# Altium schematic sheet MCU.SchDoc
size A3; DocumentNumber: 5; SheetNumber: 5; SheetTotal: 10
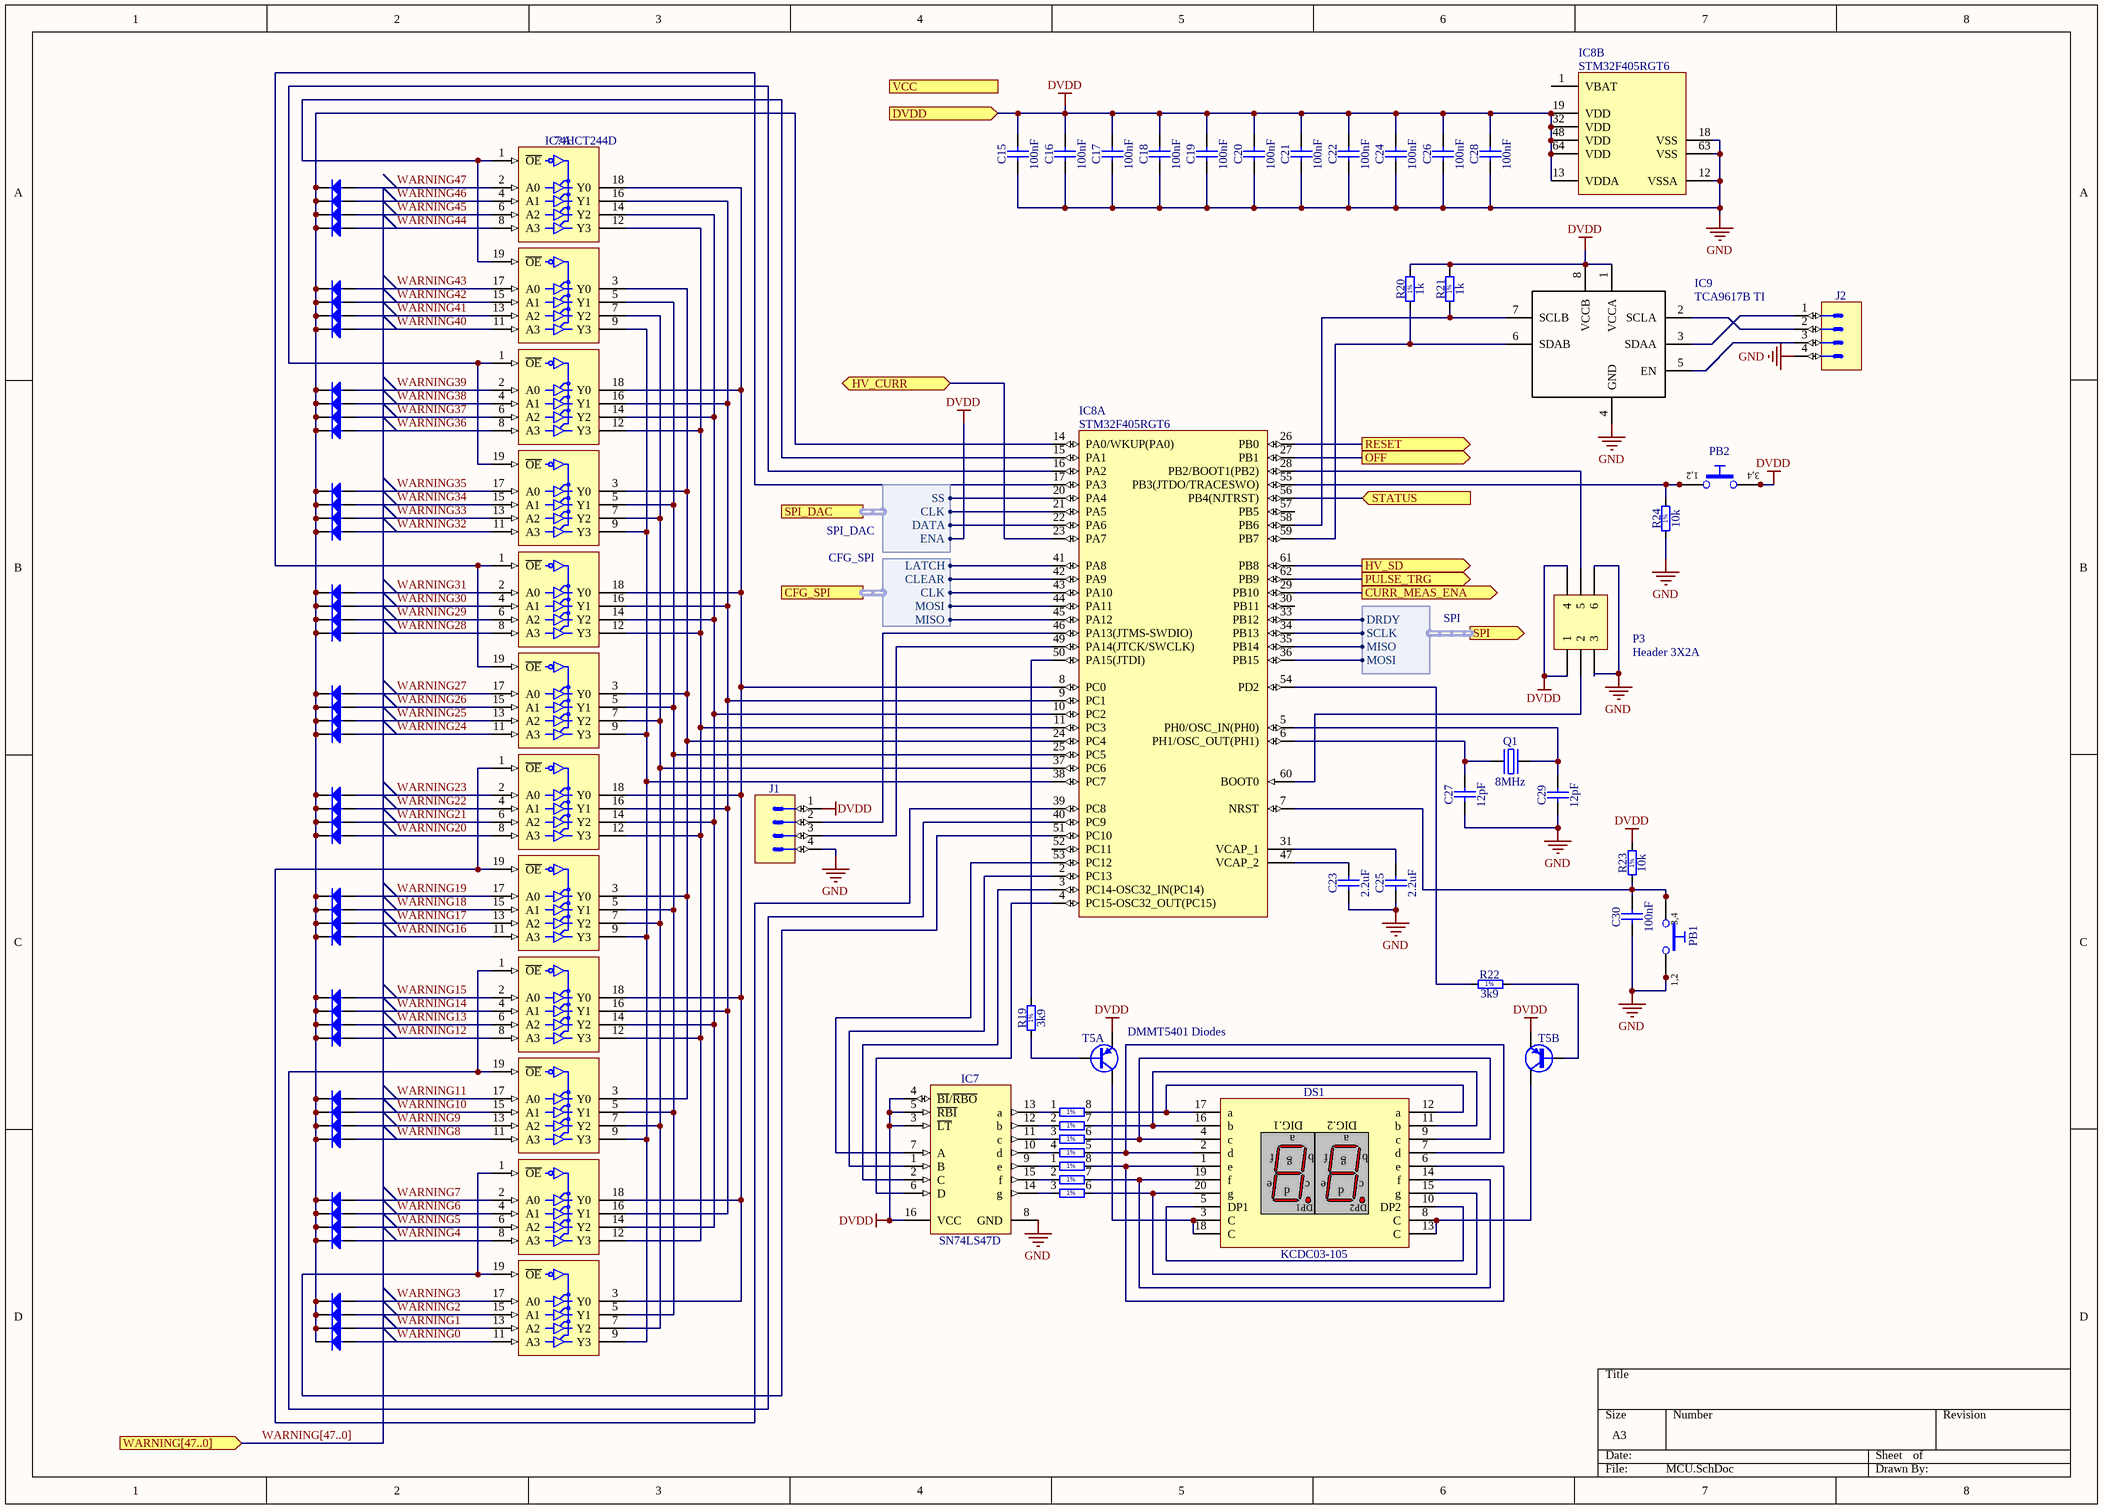
[diagram p0: MCU.SchDoc]

## Parts
(Parts that share a designator on the sheet are numbered #1, #2 ... from top to bottom, then left to right.)
C15  100nF  [CAPC2012X135N]
C16  100nF  [CAPC2012X135N]
C17  100nF  [CAPC2012X135N]
C18  100nF  [CAPC2012X135N]
C19  100nF  [CAPC2012X135N]
C20  100nF  [CAPC2012X135N]
C21  100nF  [CAPC2012X135N]
C22  100nF  [CAPC2012X135N]
C23  2.2uF  [CAPC3216X180N]
C24  100nF  [CAPC2012X135N]
C25  2.2uF  [CAPC3216X180N]
C26  100nF  [CAPC2012X135N]
C27  12pF  [CAPC2012X135N]
C28  100nF  [CAPC2012X135N]
C29  12pF  [CAPC2012X135N]
C30  100nF  [CAPC2012X135N]
D3  MCL4148-TR3  [DIOMELF1911N]  (value not drawn)
D4  MCL4148-TR3  [DIOMELF1911N]  (value not drawn)
D5  MCL4148-TR3  [DIOMELF1911N]  (value not drawn)
D6  MCL4148-TR3  [DIOMELF1911N]  (value not drawn)
D7  MCL4148-TR3  [DIOMELF1911N]  (value not drawn)
D8#1  MCL4148-TR3  [DIOMELF1911N]  (value not drawn)
D8#2  MCL4148-TR3  [DIOMELF1911N]  (value not drawn)
D9  MCL4148-TR3  [DIOMELF1911N]  (value not drawn)
D?#1  MCL4148-TR3  [DIOMELF1911N]  (value not drawn)
D?#2  MCL4148-TR3  [DIOMELF1911N]  (value not drawn)
D?#3  MCL4148-TR3  [DIOMELF1911N]  (value not drawn)
D?#4  MCL4148-TR3  [DIOMELF1911N]  (value not drawn)
D?#5  MCL4148-TR3  [DIOMELF1911N]  (value not drawn)
D?#6  MCL4148-TR3  [DIOMELF1911N]  (value not drawn)
D?#7  MCL4148-TR3  [DIOMELF1911N]  (value not drawn)
D?#8  MCL4148-TR3  [DIOMELF1911N]  (value not drawn)
D?#9  MCL4148-TR3  [DIOMELF1911N]  (value not drawn)
D?#10  MCL4148-TR3  [DIOMELF1911N]  (value not drawn)
D?#11  MCL4148-TR3  [DIOMELF1911N]  (value not drawn)
D?#12  MCL4148-TR3  [DIOMELF1911N]  (value not drawn)
D?#13  MCL4148-TR3  [DIOMELF1911N]  (value not drawn)
D?#14  MCL4148-TR3  [DIOMELF1911N]  (value not drawn)
D?#15  MCL4148-TR3  [DIOMELF1911N]  (value not drawn)
D?#16  MCL4148-TR3  [DIOMELF1911N]  (value not drawn)
D?#17  MCL4148-TR3  [DIOMELF1911N]  (value not drawn)
D?#18  MCL4148-TR3  [DIOMELF1911N]  (value not drawn)
D?#19  MCL4148-TR3  [DIOMELF1911N]  (value not drawn)
D?#20  MCL4148-TR3  [DIOMELF1911N]  (value not drawn)
D?#21  MCL4148-TR3  [DIOMELF1911N]  (value not drawn)
D?#22  MCL4148-TR3  [DIOMELF1911N]  (value not drawn)
D?#23  MCL4148-TR3  [DIOMELF1911N]  (value not drawn)
D?#24  MCL4148-TR3  [DIOMELF1911N]  (value not drawn)
D?#25  MCL4148-TR3  [DIOMELF1911N]  (value not drawn)
D?#26  MCL4148-TR3  [DIOMELF1911N]  (value not drawn)
D?#27  MCL4148-TR3  [DIOMELF1911N]  (value not drawn)
D?#28  MCL4148-TR3  [DIOMELF1911N]  (value not drawn)
D?#29  MCL4148-TR3  [DIOMELF1911N]  (value not drawn)
D?#30  MCL4148-TR3  [DIOMELF1911N]  (value not drawn)
D?#31  MCL4148-TR3  [DIOMELF1911N]  (value not drawn)
D?#32  MCL4148-TR3  [DIOMELF1911N]  (value not drawn)
D?#33  MCL4148-TR3  [DIOMELF1911N]  (value not drawn)
D?#34  MCL4148-TR3  [DIOMELF1911N]  (value not drawn)
D?#35  MCL4148-TR3  [DIOMELF1911N]  (value not drawn)
D?#36  MCL4148-TR3  [DIOMELF1911N]  (value not drawn)
D?#37  MCL4148-TR3  [DIOMELF1911N]  (value not drawn)
D?#38  MCL4148-TR3  [DIOMELF1911N]  (value not drawn)
D?#39  MCL4148-TR3  [DIOMELF1911N]  (value not drawn)
D?#40  MCL4148-TR3  [DIOMELF1911N]  (value not drawn)
DS1  KCDC03-105  [DS_KINGBRIGHT_KCDC03-105]
IC7  SN74LS47D  [SOIC127P600X175-16N]
IC8  STM32F405RGT6  [QFP50P1200X1200X160-64N]  (parts A,B of 2)
IC9  TCA9617B TI  [TSOP65P490X110-8N]
IC?#1  74HCT244D  [SOIC127P1032X265-20N]  (part A of 2)
IC?#2  74HCT244D  [SOIC127P1032X265-20N]  (value not drawn)  (part B of 2)
IC?#3  74HCT244D  [SOIC127P1032X265-20N]  (value not drawn)  (part A of 2)
IC?#4  74HCT244D  [SOIC127P1032X265-20N]  (value not drawn)  (part B of 2)
IC?#5  74HCT244D  [SOIC127P1032X265-20N]  (value not drawn)  (part A of 2)
IC?#6  74HCT244D  [SOIC127P1032X265-20N]  (value not drawn)  (part B of 2)
IC?#7  74HCT244D  [SOIC127P1032X265-20N]  (value not drawn)  (part A of 2)
IC?#8  74HCT244D  [SOIC127P1032X265-20N]  (value not drawn)  (part B of 2)
IC?#9  74HCT244D  [SOIC127P1032X265-20N]  (value not drawn)  (part A of 2)
IC?#10  74HCT244D  [SOIC127P1032X265-20N]  (value not drawn)  (part B of 2)
IC?#11  74HCT244D  [SOIC127P1032X265-20N]  (value not drawn)  (part A of 2)
IC?#12  74HCT244D  [SOIC127P1032X265-20N]  (value not drawn)  (part B of 2)
J1  Header 4  [PRECI-DIP_350-V3-104-00-001101]  (value not drawn)
J2  Header 4  [PRECI-DIP_350-V3-104-00-001101]  (value not drawn)
P3  Header 3X2A  [HDR2X3_CEN]
PB1  Push Button  [PB_OMRON_B3F-1000]  (value not drawn)
PB2  Push Button  [PB_OMRON_B3F-1000]  (value not drawn)
Q1  8MHz  [XTAL_TXC_7A]
R19  3k9  [RESC2012X60N]
R20  1k  [RESC2012X60N]
R21  1k  [RESC2012X60N]
R22  3k9  [RESC2012X60N]
R23  10k  [RESC2012X60N]
R24  10k  [RESC2012X60N]
RN1  220  [RN_VISHAY_CRA12E08]  (value not drawn)  (parts A,B,C,D of 4)
RN2  220  [RN_VISHAY_CRA12E08]  (value not drawn)  (parts A,B,C of 4)
T5  DMMT5401 Diodes  [SOT95P280X145-6N]  (parts A,B of 2)

## Ports
CFG_SPI (harness CFG_SPI), CURR_MEAS_ENA (out), DVDD (in), HV_CURR (bidir), HV_SD (out), OFF (out), PULSE_TRG (out), RESET (out), SPI (out, harness SPI), SPI_DAC (harness SPI_DAC), STATUS (in), VCC (in), WARNING[47..0] (in)

## Harnesses
SPI_DAC: SS, CLK, DATA, ENA
SPI: DRDY, MISO, SCLK, MOSI
CFG_SPI: LATCH, CLEAR, CLK, MOSI, MISO

## Nets
DVDD: C15.2 C16.2 C17.2 C18.2 C19.2 C20.2 C21.2 C22.2 C24.2 C26.2 C28.2 IC7.3(~{LT}) IC7.4(~{BI}/~{RBO}) IC7.5(~{RBI}) IC7.16(VCC) IC8.13(VDDA) IC8.19(VDD) IC8.32(VDD) IC8.48(VDD) IC8.64(VDD) IC9.1(VCCA) IC9.8(VCCB) J1.1 P3.1 P3.4 PB2.3 PB2.4 R20.2 R21.2 R23.2 T5.5(E) T5.6(E) ; port DVDD, port SPI_DAC.ENA
GND: C15.1 C16.1 C17.1 C18.1 C19.1 C20.1 C21.1 C22.1 C23.1 C24.1 C25.1 C26.1 C27.1 C28.1 C29.1 C30.1 IC7.8(GND) IC8.12(VSSA) IC8.18(VSS) IC8.63(VSS) IC9.4(GND) IC?#1.10(GND) IC?#2.10(GND) IC?#3.10(GND) IC?#4.10(GND) IC?#5.10(GND) IC?#6.10(GND) IC?#7.10(GND) IC?#8.10(GND) IC?#9.10(GND) IC?#10.10(GND) IC?#11.10(GND) IC?#12.10(GND) J1.4 J2.4 P3.3 P3.6 PB1.1 PB1.2 R24.1
VCC: IC?#1.20(VCC) IC?#2.20(VCC) IC?#3.20(VCC) IC?#4.20(VCC) IC?#5.20(VCC) IC?#6.20(VCC) IC?#7.20(VCC) IC?#8.20(VCC) IC?#9.20(VCC) IC?#10.20(VCC) IC?#11.20(VCC) IC?#12.20(VCC)
CURR_MEAS_ENA: IC8.29(PB10) ; port CURR_MEAS_ENA
HV_CURR: IC8.23(PA7) ; port HV_CURR
HV_SD: IC8.61(PB8) ; port HV_SD
OFF: IC8.27(PB1) ; port OFF
PULSE_TRG: IC8.62(PB9) ; port PULSE_TRG
RESET: IC8.26(PB0) ; port RESET
STATUS: IC8.56(PB4(NJTRST)) ; port STATUS
WARNING0: D?#40.2(A) IC?#12.11(A3)
WARNING1: D?#39.2(A) IC?#12.13(A2)
WARNING2: D?#38.2(A) IC?#12.15(A1)
WARNING3: D?#37.2(A) IC?#12.17(A0)
WARNING4: D?#36.2(A) IC?#11.8(A3)
WARNING5: D?#35.2(A) IC?#11.6(A2)
WARNING6: D?#34.2(A) IC?#11.4(A1)
WARNING7: D?#33.2(A) IC?#11.2(A0)
WARNING8: D?#32.2(A) IC?#10.11(A3)
WARNING9: D?#31.2(A) IC?#10.13(A2)
WARNING10: D?#30.2(A) IC?#10.15(A1)
WARNING11: D?#29.2(A) IC?#10.17(A0)
WARNING12: D?#28.2(A) IC?#9.8(A3)
WARNING13: D?#27.2(A) IC?#9.6(A2)
WARNING14: D?#26.2(A) IC?#9.4(A1)
WARNING15: D?#25.2(A) IC?#9.2(A0)
WARNING16: D?#24.2(A) IC?#8.11(A3)
WARNING17: D?#23.2(A) IC?#8.13(A2)
WARNING18: D?#22.2(A) IC?#8.15(A1)
WARNING19: D?#21.2(A) IC?#8.17(A0)
WARNING20: D?#20.2(A) IC?#7.8(A3)
WARNING21: D?#19.2(A) IC?#7.6(A2)
WARNING22: D?#18.2(A) IC?#7.4(A1)
WARNING23: D?#17.2(A) IC?#7.2(A0)
WARNING24: D?#16.2(A) IC?#6.11(A3)
WARNING25: D?#15.2(A) IC?#6.13(A2)
WARNING26: D?#14.2(A) IC?#6.15(A1)
WARNING27: D?#13.2(A) IC?#6.17(A0)
WARNING28: D?#12.2(A) IC?#5.8(A3)
WARNING29: D?#11.2(A) IC?#5.6(A2)
WARNING30: D?#10.2(A) IC?#5.4(A1)
WARNING31: D?#9.2(A) IC?#5.2(A0)
WARNING32: D?#8.2(A) IC?#4.11(A3)
WARNING33: D?#7.2(A) IC?#4.13(A2)
WARNING34: D?#6.2(A) IC?#4.15(A1)
WARNING35: D?#5.2(A) IC?#4.17(A0)
WARNING36: D?#4.2(A) IC?#3.8(A3)
WARNING37: D?#3.2(A) IC?#3.6(A2)
WARNING38: D?#2.2(A) IC?#3.4(A1)
WARNING39: D?#1.2(A) IC?#3.2(A0)
WARNING40: D9.2(A) IC?#2.11(A3)
WARNING41: D8#2.2(A) IC?#2.13(A2)
WARNING42: D7.2(A) IC?#2.15(A1)
WARNING43: D8#1.2(A) IC?#2.17(A0)
WARNING44: D6.2(A) IC?#1.8(A3)
WARNING45: D5.2(A) IC?#1.6(A2)
WARNING46: D4.2(A) IC?#1.4(A1)
WARNING47: D3.2(A) IC?#1.2(A0)
NetC23_2: C23.2 IC8.47(VCAP_2)
NetC25_2: C25.2 IC8.31(VCAP_1)
NetC27_2: C27.2 IC8.6(PH1/OSC_OUT(PH1)) Q1.1(OSC1)
NetC29_2: C29.2 IC8.5(PH0/OSC_IN(PH0)) Q1.2(OSC2)
NetC30_2: C30.2 IC8.7(NRST) PB1.3 PB1.4 R23.1
NetD3_1: D3.1(C) D4.1(C) D5.1(C) D6.1(C) D7.1(C) D8#1.1(C) D8#2.1(C) D9.1(C) D?#1.1(C) D?#2.1(C) D?#3.1(C) D?#4.1(C) D?#5.1(C) D?#6.1(C) D?#7.1(C) D?#8.1(C) D?#9.1(C) D?#10.1(C) D?#11.1(C) D?#12.1(C) D?#13.1(C) D?#14.1(C) D?#15.1(C) D?#16.1(C) D?#17.1(C) D?#18.1(C) D?#19.1(C) D?#20.1(C) D?#21.1(C) D?#22.1(C) D?#23.1(C) D?#24.1(C) D?#25.1(C) D?#26.1(C) D?#27.1(C) D?#28.1(C) D?#29.1(C) D?#30.1(C) D?#31.1(C) D?#32.1(C) D?#33.1(C) D?#34.1(C) D?#35.1(C) D?#36.1(C) D?#37.1(C) D?#38.1(C) D?#39.1(C) D?#40.1(C) IC8.14(PA0/WKUP(PA0))
NetDS1_1: DS1.1(e) DS1.6(e) RN2.8
NetDS1_2: DS1.2(d) DS1.7(d) RN1.5
NetDS1_3: DS1.3(C) DS1.18(C) T5.1(C)
NetDS1_4: DS1.4(c) DS1.9(c) RN1.6
NetDS1_5: DS1.5(DP1) DS1.10(DP2)
NetDS1_8: DS1.8(C) DS1.13(C) T5.4(C)
NetDS1_11: DS1.11(b) DS1.16(b) RN1.7
NetDS1_12: DS1.12(a) DS1.17(a) RN1.8
NetDS1_14: DS1.14(f) DS1.19(f) RN2.7
NetDS1_15: DS1.15(g) DS1.20(g) RN2.6
NetIC7_1: IC7.1(B) IC8.2(PC13)
NetIC7_2: IC7.2(C) IC8.3(PC14-OSC32_IN(PC14))
NetIC7_6: IC7.6(D) IC8.4(PC15-OSC32_OUT(PC15))
NetIC7_7: IC7.7(A) IC8.53(PC12)
NetIC7_9: IC7.9(e) RN2.1
NetIC7_10: IC7.10(d) RN1.4
NetIC7_11: IC7.11(c) RN1.3
NetIC7_12: IC7.12(b) RN1.2
NetIC7_13: IC7.13(a) RN1.1
NetIC7_14: IC7.14(g) RN2.3
NetIC7_15: IC7.15(f) RN2.2
NetIC8_8: IC8.8(PC0) IC?#1.18(Y0) IC?#3.18(Y0) IC?#5.18(Y0) IC?#7.18(Y0) IC?#9.18(Y0) IC?#11.18(Y0) IC?#12.3(Y0)
NetIC8_9: IC8.9(PC1) IC?#1.16(Y1) IC?#3.16(Y1) IC?#5.16(Y1) IC?#7.16(Y1) IC?#9.16(Y1) IC?#11.16(Y1)
NetIC8_10: IC8.10(PC2) IC?#1.14(Y2) IC?#3.14(Y2) IC?#5.14(Y2) IC?#7.14(Y2) IC?#9.14(Y2) IC?#11.14(Y2)
NetIC8_11: IC8.11(PC3) IC?#1.12(Y3) IC?#3.12(Y3) IC?#5.12(Y3) IC?#7.12(Y3) IC?#9.12(Y3) IC?#11.12(Y3)
NetIC8_15: IC8.15(PA1) IC?#1.1(~{OE}) IC?#2.19(~{OE})
NetIC8_16: IC8.16(PA2) IC?#3.1(~{OE}) IC?#4.19(~{OE})
NetIC8_17: IC8.17(PA3) IC?#5.1(~{OE}) IC?#6.19(~{OE})
NetIC8_20: IC8.20(PA4) ; port SPI_DAC.SS
NetIC8_21: IC8.21(PA5) ; port SPI_DAC.CLK
NetIC8_22: IC8.22(PA6) ; port SPI_DAC.DATA
NetIC8_24: IC8.24(PC4) IC?#2.3(Y0) IC?#4.3(Y0) IC?#6.3(Y0) IC?#8.3(Y0) IC?#10.3(Y0)
NetIC8_25: IC8.25(PC5) IC?#2.5(Y1) IC?#4.5(Y1) IC?#6.5(Y1) IC?#8.5(Y1) IC?#10.5(Y1) IC?#12.5(Y1)
NetIC8_28: IC8.28(PB2/BOOT1(PB2)) P3.5
NetIC8_33: IC8.33(PB12) ; port SPI.DRDY
NetIC8_34: IC8.34(PB13) ; port SPI.SCLK
NetIC8_35: IC8.35(PB14) ; port SPI.MISO
NetIC8_36: IC8.36(PB15) ; port SPI.MOSI
NetIC8_37: IC8.37(PC6) IC?#2.7(Y2) IC?#4.7(Y2) IC?#6.7(Y2) IC?#8.7(Y2) IC?#10.7(Y2) IC?#12.7(Y2)
NetIC8_38: IC8.38(PC7) IC?#2.9(Y3) IC?#4.9(Y3) IC?#6.9(Y3) IC?#8.9(Y3) IC?#10.9(Y3) IC?#12.9(Y3)
NetIC8_39: IC8.39(PC8) IC?#7.1(~{OE}) IC?#8.19(~{OE})
NetIC8_40: IC8.40(PC9) IC?#9.1(~{OE}) IC?#10.19(~{OE})
NetIC8_41: IC8.41(PA8) ; port CFG_SPI.LATCH
NetIC8_42: IC8.42(PA9) ; port CFG_SPI.CLEAR
NetIC8_43: IC8.43(PA10) ; port CFG_SPI.CLK
NetIC8_44: IC8.44(PA11) ; port CFG_SPI.MOSI
NetIC8_45: IC8.45(PA12) ; port CFG_SPI.MISO
NetIC8_46: IC8.46(PA13(JTMS-SWDIO)) J1.2
NetIC8_49: IC8.49(PA14(JTCK/SWCLK)) J1.3
NetIC8_50: IC8.50(PA15(JTDI)) R19.2
NetIC8_51: IC8.51(PC10) IC?#11.1(~{OE}) IC?#12.19(~{OE})
NetIC8_54: IC8.54(PD2) R22.1
NetIC8_55: IC8.55(PB3(JTDO/TRACESWO)) PB2.1 PB2.2 R24.2
NetIC8_58: IC8.58(PB6) IC9.7(SCLB) R21.1
NetIC8_59: IC8.59(PB7) IC9.6(SDAB) R20.1
NetIC8_60: IC8.60(BOOT0) P3.2
NetIC9_2: IC9.2(SCLA) J2.2
NetIC9_3: IC9.3(SDAA) J2.1
NetIC9_5: IC9.5(EN) J2.3
NetR19_1: R19.1 T5.2(B)
NetR22_2: R22.2 T5.3(B)

Not connected (* = marked no-connect by the designer): IC8 1(VBAT) 30(PB11) 52(PC11) 57(PB5)

## Buses and harness runs
bus WARNING[47..0] = port WARNING[47..0]

## Notes on the sheet
- (in symbol DS_KINGBRIGHT_KCDC03-105) DIG.1; DIG.2
- (in symbol PB_OMRON_B3F-1000) 3,4; 1,2
- (in symbol R0805_1K_1%_0.125W_100PPM) 1%
- (in symbol R0805_3K9_1%_0.125W_100PPM) 1%
- (in symbol R0805_10K_1%_0.125W_100PPM) 1%
- (in symbol RN_220R_VISHAY_CRA12E083220RF, part A) 1%
- (in symbol RN_220R_VISHAY_CRA12E083220RF, part B) 1%
- (in symbol RN_220R_VISHAY_CRA12E083220RF, part C) 1%
- (in symbol RN_220R_VISHAY_CRA12E083220RF, part D) 1%

## Library data of the parts
C15-C22 C24 C26 C28 C30 = CC0805_100NF_50V_10%_X7R: Non-polarised capacitor; Part Description: SMD Multilayer Chip Ceramic Capacitor; Manufacturer: GENERIC; Manufacturer1 Part Number: C2012X7R1H104K085AA; Voltage: 50V; TC: X7R; Tolerance: ±10%; Part Number: CC0805_100NF_50V_10%_X7R; Component Kind: Standard; Component Type: Standard; Pin Count: 2; Value: 100nF; Status: Preferred; Manufacturer Part Number: CC0805_100NF_50V_10%_X7R; Case: 0805; Mounted: Yes; Socket: No; SMD: Yes; Sense: No; Manufacturer1 Example: TDK; Manufacturer1 ComponentHeight: 1mm; HelpURL: \\cern.ch\dfs\Applications\Altium\Datasheets\CC0805_X7R_TDK_C.pdf; Author: CERN DEM JLC; CreateDate: 03.12.2007; LatestRevisionDate: 22.04.2015
C23 C25 = CC1206_2.2UF_50V_10%_X7R: Non-polarised capacitor; Part Description: SMD Multilayer Chip Ceramic Capacitor; Manufacturer: GENERIC; Manufacturer1 Part Number: C1206C225K5RACTU; Voltage: 50V; TC: X7R; Tolerance: ±10%; Part Number: CC1206_2.2UF_50V_10%_X7R; Component Kind: Standard; Component Type: Standard; Pin Count: 2; Value: 2.2uF; Status: Preferred; Manufacturer Part Number: CC1206_2.2uF_50V_10%_X7R; Case: 1206; Mounted: Yes; Socket: No; SMD: Yes; Sense: No; Manufacturer1 Example: KEMET; Manufacturer1 ComponentHeight: 1.8mm; HelpURL: \\cern.ch\dfs\Applications\Altium\Datasheets\CC1206_X7R_KEMET.pdf; Author: CERN DEM MR; CreateDate: 06.06.2016; LatestRevisionDate: 06.06.2016
C27 C29 = CC0805_12PF_50V_5%_NP0: Non-polarised capacitor; Part Description: SMD Multilayer Chip Ceramic Capacitor; Manufacturer: GENERIC; Manufacturer1 Part Number: 223886115129; Voltage: 50V; TC: C0G/NP0; Tolerance: ±5%; Part Number: CC0805_12PF_50V_5%_NP0; Component Kind: Standard; Component Type: Standard; Pin Count: 2; Value: 12pF; Status: Preferred; Manufacturer Part Number: CC0805_12PF_50V_5%_NP0; Case: 0805; Mounted: Yes; Socket: No; SMD: Yes; Sense: No; Manufacturer1 Example: PHYCOMP; Manufacturer1 ComponentHeight: 1.35mm; HelpURL: \\cern.ch\dfs\Applications\Altium\Datasheets\CC0805_NP0_PHYCOMP.pdf; Author: CERN DEM JLC; CreateDate: 03.12.2007; LatestRevisionDate: 03.12.2007
D3-D7 D8#1 D8#2 D9 D?#1-D?#40 = MCL4148-TR3: Diode; Part Description: Small Signal Fast Switching Diode; Manufacturer: VISHAY GENERAL SEMICONDUCTOR; Voltage: 75V; Power: 200mA; PressFit: No; Bonding: No; Part Number: MCL4148-TR3; Component Kind: Standard; Component Type: Standard; Device: MCL4148-TR3; PackageDescription: MELF Diode, 2-Leads, Body 1.7x1.15mm, IPC Medium Density; Status: Not recommended; Manufacturer Part Number: MCL4148-TR3; Pin Count: 2; Mounted: Yes; Socket: No; SMD: Yes; Sense: No; ComponentHeight: 1.35mm; HelpURL: \\cern.ch\dfs\Applications\Altium\Datasheets\MCL4148-TR3.pdf; Author: CERN DEM JLC; CreateDate: 10.11.2014; LatestRevisionDate: 10.11.2014
DS1 = DS_KINGBRIGHT_KCDC03-105: Dual Digit, SMD 7-Segment Common Cathode Hyper Red Display; PressFit: No; Bonding: No; Part Number: DS_KINGBRIGHT_KCDC03-105; Component Kind: Standard; Component Type: Standard; Color: Hyper Red; Device: KCDC03-105; PackageDescription: 20-Leads, Body 14.8x12mm, Pitch 1.5mm, Hyper Red SMD Common Cathode Dual 7-SegmentDisplay; Part Description: Dual Digit, SMD 7-Segment Common Cathode Hyper Red Display; Manufacturer: KINGBRIGHT; Manufacturer Part Number: KCDC03-105; Pin Count: 20; Mounted: Yes; Socket: No; SMD: Yes; Sense: No; ComponentHeight: 3.75mm; HelpURL: \\cern.ch\dfs\Applications\Altium\Datasheets\DS_KINGBRIGHT_KCDC03-105.pdf; Author: CERN DEM JLC; CreateDate: 12.05.2014; LatestRevisionDate: 21.10.2016
IC7 = SN74LS47D: BCD-to-Seven-Segment Decoder/Driver; Manufacturer: TEXAS INSTRUMENTS; PressFit: No; Bonding: No; Part Number: SN74LS47D; Component Kind: Standard; Component Type: Standard; Device: SN74LS47D; PackageDescription: SOIC 16, Pitch 1.27mm - Body 4x10mm, IPC Medium Density; Part Description: BCD-to-Seven-Segment Decoder/Driver; Manufacturer Part Number: SN74LS47D; Pin Count: 16; Case: SOIC16; Mounted: Yes; Socket: No; SMD: Yes; Sense: No; ComponentHeight: 1.75mm; Author: CERN DEM JMW; HelpURL: \\cern.ch\dfs\Applications\Altium\Datasheets\SN74LS47D.pdf; CreateDate: 04.10.2012; LatestRevisionDate: 04.10.2012
IC8 = STM32F405RGT6: ARM Cortex-M4 32-bit MCU+FPU, 210DMIPS, 1024kB Flash, 192kB+4kB RAM, 51 I/Os, 64-pin LQFP, Industrial Grade –40 to 85°C; Manufacturer: ST MICROELECTRONICS; PressFit: No; Bonding: No; Part Number: STM32F405RGT6; Component Kind: Standard; Component Type: Standard; Device: STM32F405RGT6; PackageDescription: QFP, 0.50mm pitch, square; 16 pin X 16 pin, 10.00mm X 10.00mm, 1.6mm H, IPC Medium Density; Part Description: ARM Cortex-M4 32-bit MCU+FPU, 210DMIPS, 1024kB Flash, 192kB+4kB RAM, 51 I/Os, 64-pin LQFP, Industrial Grade –40 to 85°C; Manufacturer Part Number: STM32F405RGT6; Pin Count: 64; Case: QFP64; Mounted: Yes; Socket: No; SMD: Yes; Sense: No; ComponentHeight: 1.6mm; HelpURL: \\cern.ch\dfs\Applications\Altium\Datasheets\STM32F405RGT6.pdf; Author: CERN DEM JLC; CreateDate: 20.06.2017; LatestRevisionDate: 20.06.2017
IC9 = TCA9617B: Name: TCA9617B; Manufacturer: TI
IC?#1-IC?#12 = 74HCT244D: Octal Buffer And Line Driver with 3-State Ouputs; Part Description: Octal Buffer/Line Driver with 3-State Outputs; Manufacturer: NXP SEMICONDUCTORS; PressFit: No; Bonding: No; Part Number: 74HCT244D; Component Kind: Standard; Component Type: Standard; Device: 74HCT244D; PackageDescription: SOIC, 1.27mm pitch; 20 pin, 7.50mm W X 12.80mm L X 2.65mm H body, IPC Medium Density; Manufacturer Part Number: 74HCT244D; Pin Count: 20; Case: SOIC20; Mounted: Yes; Socket: No; SMD: Yes; Sense: No; ComponentHeight: 2.65mm; Author: CERN DEM JLC; HelpURL: \\cern.ch\dfs\Applications\Altium\Datasheets\74HCT244D.pdf; CreateDate: 27.08.2013; LatestRevisionDate: 27.08.2013
J1 J2 = PRECI-DIP_350-V3-104-00-001101: Connector 4 Male; Part Description: Pitch 2.54mm, Single Row, Straight 4 Contacts PCB Header; PressFit: No; Part Number: PRECI-DIP_350-V3-104-00-001101; Component Kind: Standard; Component Type: Standard; Pin Count: 4; Family: Header 4; Mounted: Yes; Socket: No; SMD: No; Sense: No; Status: None; Manufacturer: PRECI-DIP; Manufacturer Part Number: 350-V3-104-00-001101; ComponentHeight: 7.96mm; HelpURL: \\cern.ch\dfs\Applications\Altium\Datasheets\PRECI-DIP_350-V3-104-00-001101.pdf; Author: CERN DEM BC; CreateDate: 18.03.2016; LatestRevisionDate: 18.03.2016
P3 = Header 3X2A: Header, 3-Pin, Dual row; LatestRevisionDate: 17-Jul-2002; LatestRevisionNote: Re-released for DXP Platform.; Publisher: Altium Limited
PB1 PB2 = PB_OMRON_B3F-1000: Push-Button Switch SPDT; Part Description: 24VDC 50mA SPST-NO Tactile Push-Button Switch (h=4.5mm); Manufacturer: OMRON; PressFit: No; Part Number: PB_OMRON_B3F-1000; Component Kind: Standard; Component Type: Standard; Pin Count: 4; PackageDescription: 6x6mm Model, Horizontal, Flat Plunger Type (without Ground Terminal) Pushbutton Switch, OMRON B3F Series; Family: Push Button; Mounted: Yes; Socket: No; SMD: No; Sense: No; Status: None; Manufacturer Part Number: B3F-1000; ComponentHeight: 4.5mm; HelpURL: \\cern.ch\dfs\Applications\Altium\Datasheets\PB_OMRON_B3F-1000.pdf; Author: CERN DEM JMW; CreateDate: 23.10.2008; LatestRevisionDate: 06.05.2009
Q1 = XTAL_8MHZ_TXC_7A-8.000MAAE-T: Quartz Crystal; Part Description: Tolerance: ±30ppm, Stability: ±30ppm, -20°C to +70°C, 12pF, SMD Glass Seam Sealing Crystal, 7A Series; Manufacturer: TXC CORPORATION; PressFit: No; Bonding: No; Part Number: XTAL_8MHZ_TXC_7A-8.000MAAE-T; Component Kind: Standard; Component Type: Standard; PackageDescription: 2 Pins, 3.2x5mm, SMD Glass Seam Sealing Crystal, 7A Serie; Value: 8MHz; Manufacturer Part Number: 7A-8.000MAAE-T; Pin Count: 2; Mounted: Yes; Socket: No; SMD: Yes; Sense: No; ComponentHeight: 1.2mm; HelpURL: \\cern.ch\dfs\Applications\Altium\Datasheets\XTAL_TXC_7A.pdf; Author: CERN DEM JLC; CreateDate: 09.10.2014; LatestRevisionDate: 12.11.2014
R19 R22 = R0805_3K9_1%_0.125W_100PPM: Resistor - 1%; Part Description: General Purpose Thick Film Chip Resistor; Manufacturer: GENERIC; Manufacturer1 Part Number: NRC10F3901TRF; Power: 0.125W; TC: ±100ppm/°C; PressFit: No; Part Number: R0805_3K9_1%_0.125W_100PPM; Component Kind: Standard; Component Type: Standard; Pin Count: 2; Value: 3k9; Status: Preferred; Tolerance: ±1%; Manufacturer Part Number: R0805_3K9_1%_0.125W_100PPM; Case: 0805; Mounted: Yes; Sense: No; Socket: No; SMD: Yes; Manufacturer1 Example: NIC COMPONENT; Manufacturer1 ComponentHeight: 0.6mm; HelpURL: \\cern.ch\dfs\Applications\Altium\Datasheets\R0805_NIC_NRC.pdf; Author: CERN DEM JLC; CreateDate: 03.12.2007; LatestRevisionDate: 13.03.2008
R20 R21 = R0805_1K_1%_0.125W_100PPM: Resistor - 1%; Part Description: General Purpose Thick Film Chip Resistor; Manufacturer: GENERIC; Manufacturer1 Part Number: NRC10F1001TRF; Power: 0.125W; TC: ±100ppm/°C; PressFit: No; Part Number: R0805_1K_1%_0.125W_100PPM; Component Kind: Standard; Component Type: Standard; Pin Count: 2; Value: 1k; Status: Preferred; Tolerance: ±1%; Manufacturer Part Number: R0805_1K_1%_0.125W_100PPM; Case: 0805; Mounted: Yes; Sense: No; Socket: No; SMD: Yes; Manufacturer1 Example: NIC COMPONENT; Manufacturer1 ComponentHeight: 0.6mm; HelpURL: \\cern.ch\dfs\Applications\Altium\Datasheets\R0805_NIC_NRC.pdf; Author: CERN DEM JLC; CreateDate: 03.12.2007; LatestRevisionDate: 13.03.2008
R23 R24 = R0805_10K_1%_0.125W_100PPM: Resistor - 1%; Part Description: General Purpose Thick Film Chip Resistor; Manufacturer: GENERIC; Manufacturer1 Part Number: NRC10F1002TRF; Power: 0.125W; TC: ±100ppm/°C; PressFit: No; Part Number: R0805_10K_1%_0.125W_100PPM; Component Kind: Standard; Component Type: Standard; Pin Count: 2; Value: 10k; Status: Preferred; Tolerance: ±1%; Manufacturer Part Number: R0805_10K_1%_0.125W_100PPM; Case: 0805; Mounted: Yes; Sense: No; Socket: No; SMD: Yes; Manufacturer1 Example: NIC COMPONENT; Manufacturer1 ComponentHeight: 0.6mm; HelpURL: \\cern.ch\dfs\Applications\Altium\Datasheets\R0805_NIC_NRC.pdf; Author: CERN DEM JLC; CreateDate: 03.12.2007; LatestRevisionDate: 13.03.2008
RN1 RN2 = RN_220R_VISHAY_CRA12E083220RF: DIL8 Resistor Network 4 Isolated Resistor 1%; Part Description: Chip Resistor Array , 4 Isolated Resistors (Convex Terminal), CRA12E Series; Manufacturer: VISHAY; Power: 0.125W; TC: ±200ppm/°C; PressFit: No; Part Number: RN_220R_VISHAY_CRA12E083220RF; Component Kind: Standard; Component Type: Standard; Pin Count: 8; Value: 220; Sense: No; Tolerance: ±1%; Manufacturer Part Number: CRA12E083220RF; Mounted: Yes; Socket: No; SMD: Yes; ComponentHeight: 0.7mm; HelpURL: \\cern.ch\dfs\Applications\Altium\Datasheets\RN_VISHAY_CRA12E.pdf; Author: CERN DEM BC; CreateDate: 25.08.2015; LatestRevisionDate: 03.05.2017
T5 = DMMT5401: Name: DMMT5401; Manufacturer: Diodes